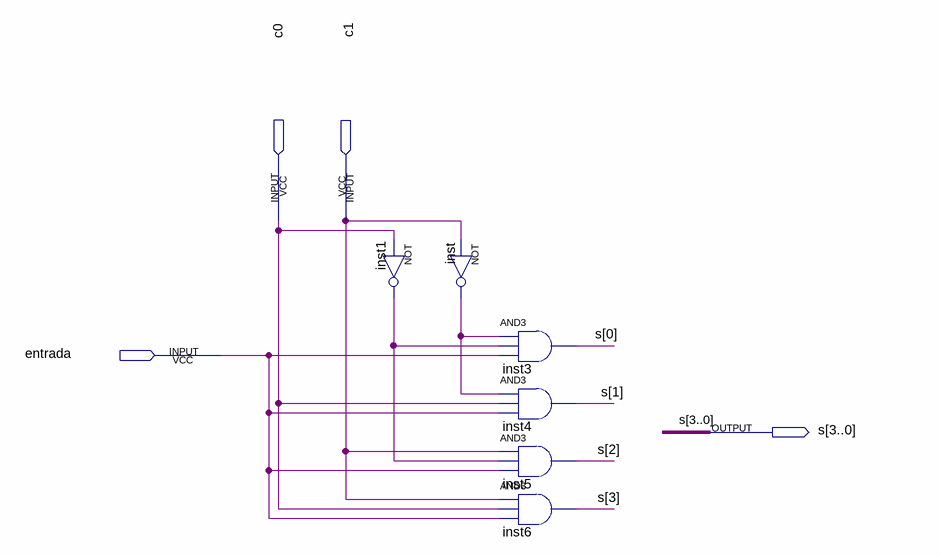
[diagram p0: schematic sheet]
// Quartus schematic deMU4.bdf as structural Verilog: 6 symbols, 4 pins
module deMU4 (
  input  c0,
  input  c1,
  input  entrada,
  output [3:0] s
);

  wire inst1_out, inst_out;

  not inst (inst_out, c1);
  not inst1 (inst1_out, c0);
  and inst3 (s[0], inst_out, inst1_out, entrada);
  and inst4 (s[1], inst_out, c0, entrada);
  and inst5 (s[2], c1, inst1_out, entrada);
  and inst6 (s[3], c1, c0, entrada);
endmodule
